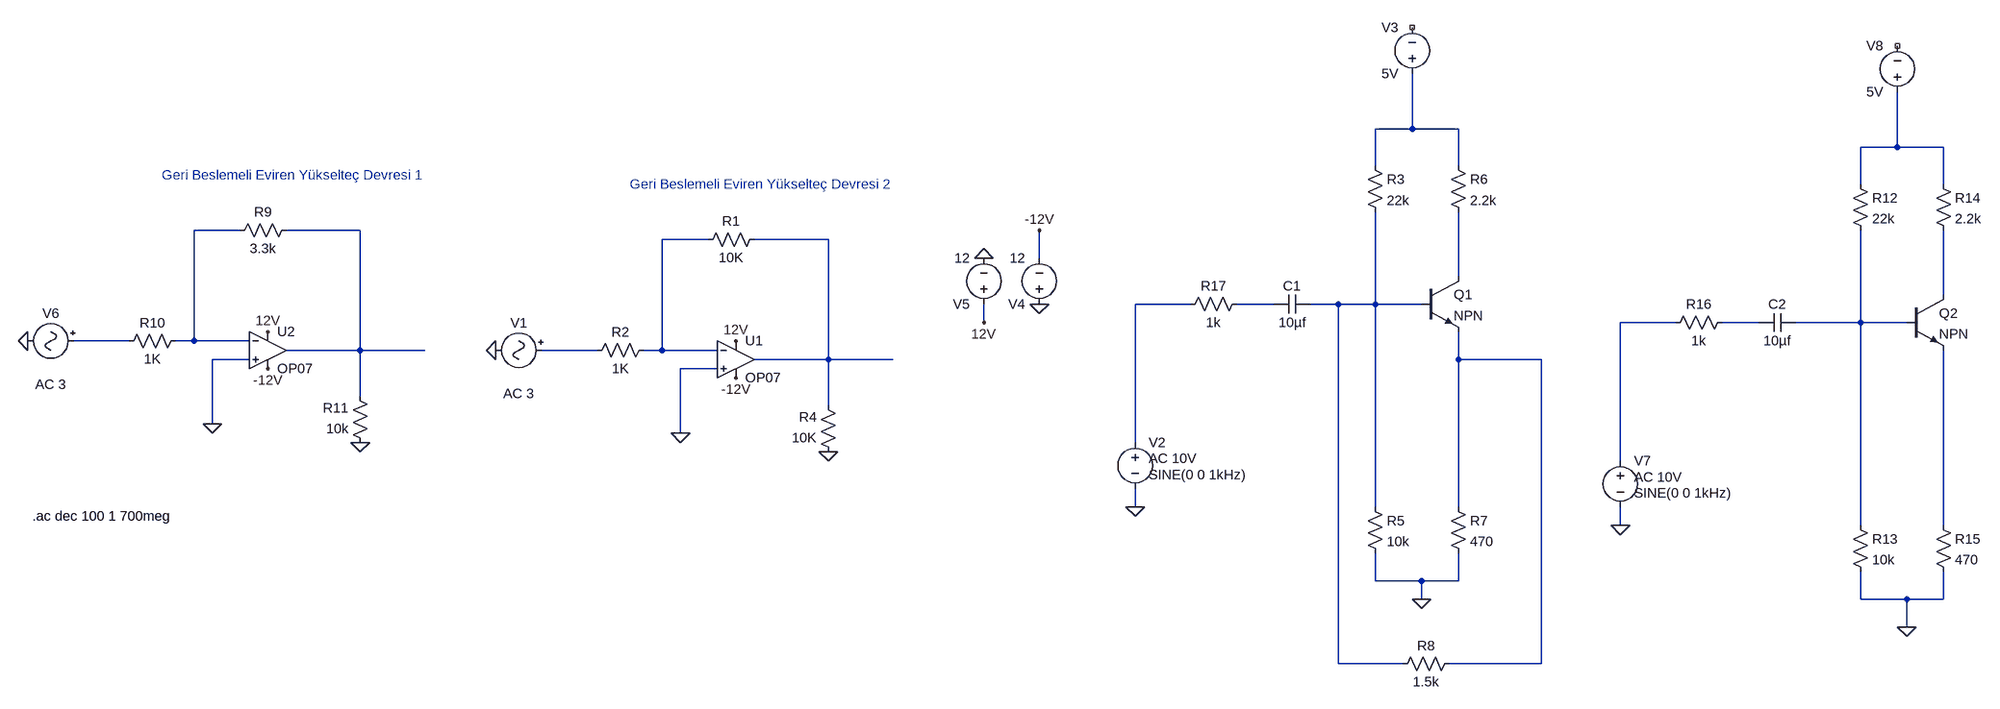
[diagram p0: schematic Draft8.asc]
Draft8.asc, the LTspice schematic file:
Version 4
SHEET 1 2392 680
WIRE 1136 -784 1136 -880
WIRE 1136 -784 1072 -784
WIRE 1216 -784 1136 -784
WIRE 2240 -752 2240 -848
WIRE 2240 -752 2176 -752
WIRE 2320 -752 2240 -752
WIRE 1072 -720 1072 -784
WIRE 1216 -720 1216 -784
WIRE 2176 -688 2176 -752
WIRE 2320 -688 2320 -752
WIRE -1648 -608 -1728 -608
WIRE -1440 -608 -1568 -608
WIRE -832 -592 -912 -592
WIRE -624 -592 -752 -592
WIRE -240 -560 -240 -608
WIRE 1216 -528 1216 -640
WIRE 2320 -496 2320 -608
WIRE 752 -480 656 -480
WIRE 896 -480 832 -480
WIRE 1008 -480 960 -480
WIRE 1072 -480 1072 -640
WIRE 1072 -480 1008 -480
WIRE 1152 -480 1072 -480
WIRE -336 -448 -336 -480
WIRE 1856 -448 1760 -448
WIRE 2000 -448 1936 -448
WIRE 2176 -448 2176 -608
WIRE 2176 -448 2064 -448
WIRE 2256 -448 2176 -448
WIRE -1840 -416 -1936 -416
WIRE -1728 -416 -1728 -608
WIRE -1728 -416 -1760 -416
WIRE -1632 -416 -1728 -416
WIRE -1440 -400 -1440 -608
WIRE -1440 -400 -1568 -400
WIRE -1328 -400 -1440 -400
WIRE -1024 -400 -1120 -400
WIRE -912 -400 -912 -592
WIRE -912 -400 -944 -400
WIRE -816 -400 -912 -400
WIRE -1632 -384 -1696 -384
WIRE -624 -384 -624 -592
WIRE -624 -384 -752 -384
WIRE -512 -384 -624 -384
WIRE 1216 -384 1216 -432
WIRE 1360 -384 1216 -384
WIRE -816 -368 -880 -368
WIRE -1440 -320 -1440 -400
WIRE -624 -304 -624 -384
WIRE -1696 -272 -1696 -384
WIRE -880 -256 -880 -368
WIRE 656 -240 656 -480
WIRE 1760 -208 1760 -448
WIRE 656 -128 656 -160
WIRE 1072 -128 1072 -480
WIRE 1216 -128 1216 -384
WIRE 1760 -96 1760 -128
WIRE 2176 -96 2176 -448
WIRE 2320 -96 2320 -400
WIRE 1072 0 1072 -48
WIRE 1152 0 1072 0
WIRE 1216 0 1216 -48
WIRE 1216 0 1152 0
WIRE 1152 32 1152 0
WIRE 2176 32 2176 -16
WIRE 2256 32 2176 32
WIRE 2320 32 2320 -16
WIRE 2320 32 2256 32
WIRE 2256 80 2256 32
WIRE 1008 144 1008 -480
WIRE 1120 144 1008 144
WIRE 1360 144 1360 -384
WIRE 1360 144 1200 144
FLAG -624 -224 0
FLAG -336 -448 12V
FLAG -336 -560 0
FLAG -240 -480 0
FLAG -240 -608 -12V
FLAG -784 -416 12V
FLAG -784 -352 -12V
FLAG -880 -256 0
FLAG -1200 -400 0
FLAG 656 -128 0
FLAG -1440 -240 0
FLAG -1600 -432 12V
FLAG -1600 -368 -12V
FLAG -1696 -272 0
FLAG -2016 -416 0
FLAG 1760 -96 0
FLAG 2256 80 0
FLAG 1152 32 0
SYMBOL OpAmps\\OP07 -784 -448 R0
SYMATTR InstName U1
SYMBOL res -736 -608 R90
WINDOW 0 0 56 VBottom 2
WINDOW 3 32 56 VTop 2
SYMATTR InstName R1
SYMATTR Value 10K
SYMBOL res -928 -416 R90
WINDOW 0 0 56 VBottom 2
WINDOW 3 32 56 VTop 2
SYMATTR InstName R2
SYMATTR Value 1K
SYMBOL res -608 -208 R180
WINDOW 0 36 76 Left 2
WINDOW 3 36 40 Left 2
SYMATTR InstName R4
SYMATTR Value 10K
SYMBOL Misc\\signal -1104 -400 R90
WINDOW 0 -32 56 VBottom 2
WINDOW 3 32 56 VTop 2
WINDOW 123 60 56 VTop 2
WINDOW 39 0 0 Left 0
SYMATTR InstName V1
SYMATTR Value ""
SYMATTR Value2 AC 3
SYMBOL voltage -240 -464 R180
WINDOW 123 0 0 Left 0
WINDOW 39 0 0 Left 0
SYMATTR InstName V4
SYMATTR Value 12
SYMBOL voltage -336 -464 R180
WINDOW 123 0 0 Left 0
WINDOW 39 0 0 Left 0
SYMATTR InstName V5
SYMATTR Value 12
SYMBOL voltage 656 -256 R0
WINDOW 123 24 44 Left 2
WINDOW 39 0 0 Left 0
WINDOW 3 24 72 Left 2
SYMATTR Value2 AC 10V
SYMATTR InstName V2
SYMATTR Value SINE(0 0 1kHz)
SYMBOL cap 960 -496 R90
WINDOW 0 0 32 VBottom 2
WINDOW 3 32 32 VTop 2
SYMATTR InstName C1
SYMATTR Value 10µf
SYMBOL res 1056 -736 R0
SYMATTR InstName R3
SYMATTR Value 22k
SYMBOL res 1056 -144 R0
SYMATTR InstName R5
SYMATTR Value 10k
SYMBOL npn 1152 -528 R0
SYMATTR InstName Q1
SYMBOL res 1200 -736 R0
SYMATTR InstName R6
SYMATTR Value 2.2k
SYMBOL res 1200 -144 R0
SYMATTR InstName R7
SYMATTR Value 470
SYMBOL voltage 1136 -864 R180
WINDOW 0 24 96 Left 2
WINDOW 3 24 16 Left 2
WINDOW 123 0 0 Left 0
WINDOW 39 0 0 Left 0
SYMATTR InstName V3
SYMATTR Value 5V
SYMBOL res 848 -496 R90
WINDOW 0 0 56 VBottom 2
WINDOW 3 32 56 VTop 2
SYMATTR InstName R17
SYMATTR Value 1k
SYMBOL res 1216 128 R90
WINDOW 0 0 56 VBottom 2
WINDOW 3 32 56 VTop 2
SYMATTR InstName R8
SYMATTR Value 1.5k
SYMBOL OpAmps\\OP07 -1600 -464 R0
SYMATTR InstName U2
SYMBOL res -1552 -624 R90
WINDOW 0 0 56 VBottom 2
WINDOW 3 32 56 VTop 2
SYMATTR InstName R9
SYMATTR Value 3.3k
SYMBOL res -1744 -432 R90
WINDOW 0 0 56 VBottom 2
WINDOW 3 32 56 VTop 2
SYMATTR InstName R10
SYMATTR Value 1K
SYMBOL res -1424 -224 R180
WINDOW 0 36 76 Left 2
WINDOW 3 36 40 Left 2
SYMATTR InstName R11
SYMATTR Value 10k
SYMBOL Misc\\signal -1920 -416 R90
WINDOW 0 -32 56 VBottom 2
WINDOW 3 32 56 VTop 2
WINDOW 123 60 56 VTop 2
WINDOW 39 0 0 Left 0
SYMATTR InstName V6
SYMATTR Value ""
SYMATTR Value2 AC 3
SYMBOL voltage 1760 -224 R0
WINDOW 123 24 44 Left 2
WINDOW 39 0 0 Left 0
WINDOW 3 24 72 Left 2
SYMATTR Value2 AC 10V
SYMATTR InstName V7
SYMATTR Value SINE(0 0 1kHz)
SYMBOL cap 2064 -464 R90
WINDOW 0 0 32 VBottom 2
WINDOW 3 32 32 VTop 2
SYMATTR InstName C2
SYMATTR Value 10µf
SYMBOL res 2160 -704 R0
SYMATTR InstName R12
SYMATTR Value 22k
SYMBOL res 2160 -112 R0
SYMATTR InstName R13
SYMATTR Value 10k
SYMBOL npn 2256 -496 R0
SYMATTR InstName Q2
SYMBOL res 2304 -704 R0
SYMATTR InstName R14
SYMATTR Value 2.2k
SYMBOL res 2304 -112 R0
SYMATTR InstName R15
SYMATTR Value 470
SYMBOL voltage 2240 -832 R180
WINDOW 0 24 96 Left 2
WINDOW 3 24 16 Left 2
WINDOW 123 0 0 Left 0
WINDOW 39 0 0 Left 0
SYMATTR InstName V8
SYMATTR Value 5V
SYMBOL res 1952 -464 R90
WINDOW 0 0 56 VBottom 2
WINDOW 3 32 56 VTop 2
SYMATTR InstName R16
SYMATTR Value 1k
TEXT -2008 -112 Left 2 !.ac dec 100 1 700meg
TEXT -968 -688 Left 2 ;Geri Beslemeli Eviren Yükselteç Devresi 2
TEXT -1784 -704 Left 2 ;Geri Beslemeli Eviren Yükselteç Devresi 1

The netlist it stands for:
* Draft8.asc
XU1 0 N005 12V -12V N006 LT1001  ; OP07, pins In+ In- V+ V- OUT
R1 N006 N005 10K
R2 N005 N016 1K
R4 0 N006 10K
V1 N016 0 AC 3
V4 0 -12V 12
V5 12V 0 12
V2 N009 0 SINE(0 0 1kHz) AC 10V
C1 N011 N010 10µf
R3 N001 N011 22k
R5 N011 0 10k
Q1 N007 N011 N017 0 NPN
R6 N001 N007 2.2k
R7 N017 0 470
V3 N001 NC_01 5V
R17 N010 N009 1k
R8 N017 N011 1.5k
XU2 0 N003 12V -12V N004 LT1001  ; OP07, pins In+ In- V+ V- OUT
R9 N004 N003 3.3k
R10 N003 N015 1K
R11 0 N004 10k
V6 N015 0 AC 3
V7 N012 0 SINE(0 0 1kHz) AC 10V
C2 N014 N013 10µf
R12 N002 N014 22k
R13 N014 0 10k
Q2 N008 N014 N018 0 NPN
R14 N002 N008 2.2k
R15 N018 0 470
V8 N002 NC_02 5V
R16 N013 N012 1k
.model NPN NPN
.model PNP PNP
.lib standard.bjt
.ac dec 100 1 700meg
* Geri Beslemeli Eviren Yükselteç Devresi 2
* Geri Beslemeli Eviren Yükselteç Devresi 1
.lib LTC.lib
.backanno
.end